# Altium project smart home.PrjPcb
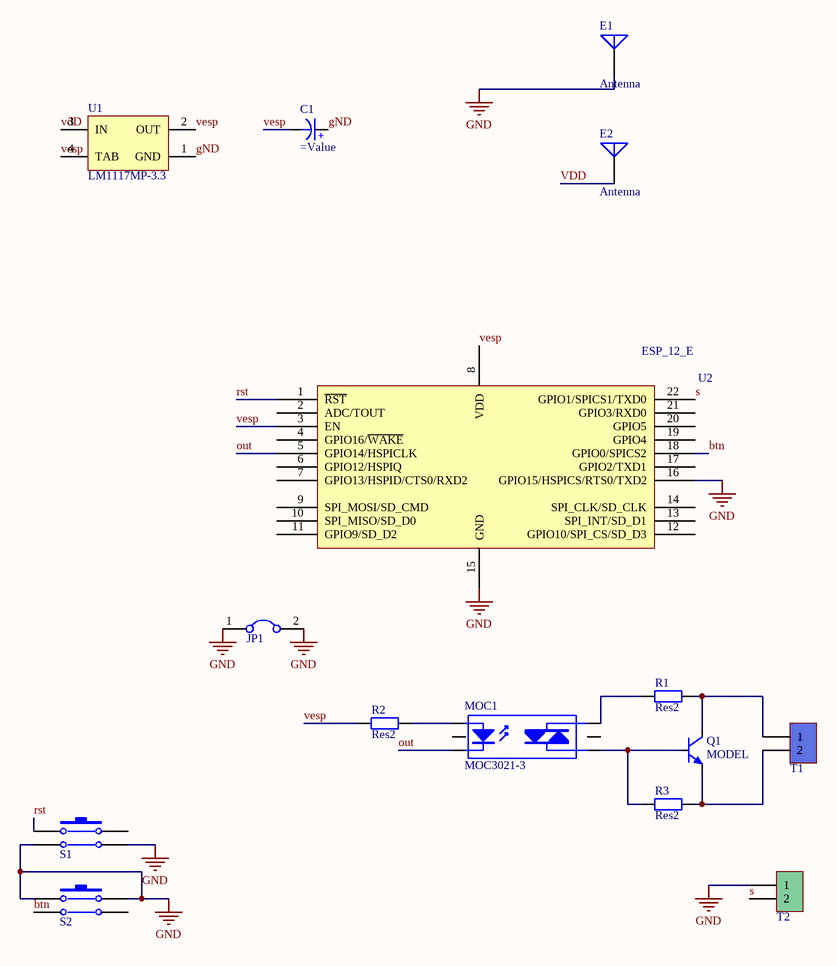
[diagram p0: smart home.SchDoc]
1 sheet, 15 parts. Net scope: global (net labels, ports and power ports of the same name join across sheets).
Board file: smart home.PcbDoc

## Sheet smart home.SchDoc
size A3

### Parts
C1  (no value)  [ELEC-CAP-RAD10-20]
E1  Antenna  [PIN1]
E2  Antenna  [PIN1]
JP1  Jumper  [Header 2X1]  (value not drawn)
MOC1  MOC3021-3  [DIP-6]
Q1  MODEL  [SOT32]
R1  Res2  [Res50]
R2  Res2  [Res50]
R3  Res2  [Res50]
S1  PUSH BUTTON DOUBLE  [PUSH BUTTON]  (value not drawn)
S2  PUSH BUTTON DOUBLE  [PUSH BUTTON]  (value not drawn)
T1  Terminal  [phoenix terminal R 2]  (value not drawn)
T2  Phoenix terminal  [phoenix terminal 2]  (value not drawn)
U1  LM1117MP-3.3  [MP04A_N]
U2  ESP_12_E  [ESP_12_E]

### Nets
gND: C1.2(+) E1.1(A) JP1.1 JP1.2 S1.3 S1.4 S2.1 S2.2 T2.1 U1.1(GND) U2.15(GND) U2.16(GPIO15/HSPICS/RTS0/TXD2)
btn: S2.3 U2.18(GPIO0/SPICS2)
out: MOC1.2(K) U2.5(GPIO14/HSPICLK)
rst: S1.1 U2.1(~{RST})
s: T2.2 U2.22(GPIO1/SPICS1/TXD0)
vdD: E2.1(A) U1.3(IN)
vesp: C1.1(-) R2.1 U1.2(OUT) U1.4(TAB) U2.3(EN) U2.8(VDD)
NetMOC1_1: MOC1.1(A) R2.2
NetMOC1_4: MOC1.4(A/K) R1.1
NetMOC1_6: MOC1.6(A/K) Q1.3(B) R3.1
NetQ1_1: Q1.1(E) R3.2 T1.2
NetQ1_2: Q1.2(C) R1.2 T1.1

Not connected (* = marked no-connect by the designer): MOC1 3(NC) 5(NC); S1 2; S2 4; U2 2(ADC/TOUT) 4(GPIO16/~{WAKE}) 6(GPIO12/HSPIQ) 7(GPIO13/HSPID/CTS0/RXD2) 9(SPI_MOSI/SD_CMD) 10(SPI_MISO/SD_D0) 11(GPIO9/SD_D2) 12(GPIO10/SPI_CS/SD_D3) 13(SPI_INT/SD_D1) 14(SPI_CLK/SD_CLK) 17(GPIO2/TXD1) 19(GPIO4) 20(GPIO5) 21(GPIO3/RXD0)

### Library data of the parts
C1 = Capacitor Electrolytic: Electrolytic Capacitor
E1 E2 = Antenna: Generic Antenna; Published: 24-Mar-1999; LatestRevisionDate: 17-Jul-2002; LatestRevisionNote: Re-released for DXP Platform.; PackageReference: PIN1; Publisher: Altium Limited
MOC1 = MOC3021-3: Opto-Triac; Designer: Seyed Mohsen Ghasemian; E-mail: picpars@gmail.com; Published: 17-11-2011; LatestRevisionDate: 17-11-2011; Publisher: www.picpars.com; WEB: www.picpars.com
Q1 = BD139: NPN Bipolar Transistor
R1-R3 = Res2: Resistor; Published: 8-Jun-2000; LatestRevisionDate: 17-Jul-2002; LatestRevisionNote: Re-released for DXP Platform.; PackageReference: AXIAL-0.4; Publisher: Altium Limited; PackageDescription: Axial Device, Thru-Hole; 2 Leads; 0.4 in Pin Spacing
S1 S2 = PUSH BUTTON DOUBLE: Switch
T1 = Terminal 1*2: Terminal 2 Pin 250VAC 16A; Designer: Seyed Mohsen Ghasemain; E-mail: picpars@gmail.com; ComponentLinkURL: www.picpars.com
T2 = Phoenix terminal 2: Terminal 2 Pin; Designer: Seyed Mohsen Ghasemain; E-mail: picpars@gmail.com; ComponentLinkURL: www.picpars.com
U1 = LM1117MP-3.3: 800mA Low-Dropout Linear Regulator; Manufacturer: National Semiconductor; CompType: LDO IC; PackageTopMarking: XYTT*N05A; PowerWise: N; Published: 4-Dec-2008; DatasheetVersion: Apr-2006; PackageVersion: revB, Apr-2003; PackageReference: MP04A; Publisher: Altium Limited; PackageDescription: Molded SOT-223, 6.50 x 3.56 x 1.6mm Body, 4 Lead, 2.3mm Pitch; PartNumber: LM1117MP-3.3; RoHS: O; PinCount: 4; DigiKeyPartNumber: LM1117MP-3.3CT-ND; Code_JEDEC: TO-261-AA; Code_IPC: SOT223-4; ComponentLink1Description: LM1117 Datasheet; ComponentLink1URL: http://www.national.com/ds/LM/LM1117.pdf; ComponentLink2Description: LM1117 Web Page; ComponentLink2URL: http://www.national.com/pf/LM/LM1117.html; ComponentLink3Description: MP04A Package Page; ComponentLink3URL: http://www.national.com/packaging/folders/mp04a.html
U2 = ESP_12_E: ESP-12 Wi-Fi Module by AI-Thinker; IC: ESP8266-EX; Vendor: Ai-thinker